# EasyEDA Pro project PCB_Power_supply.epro

# Board PCB7
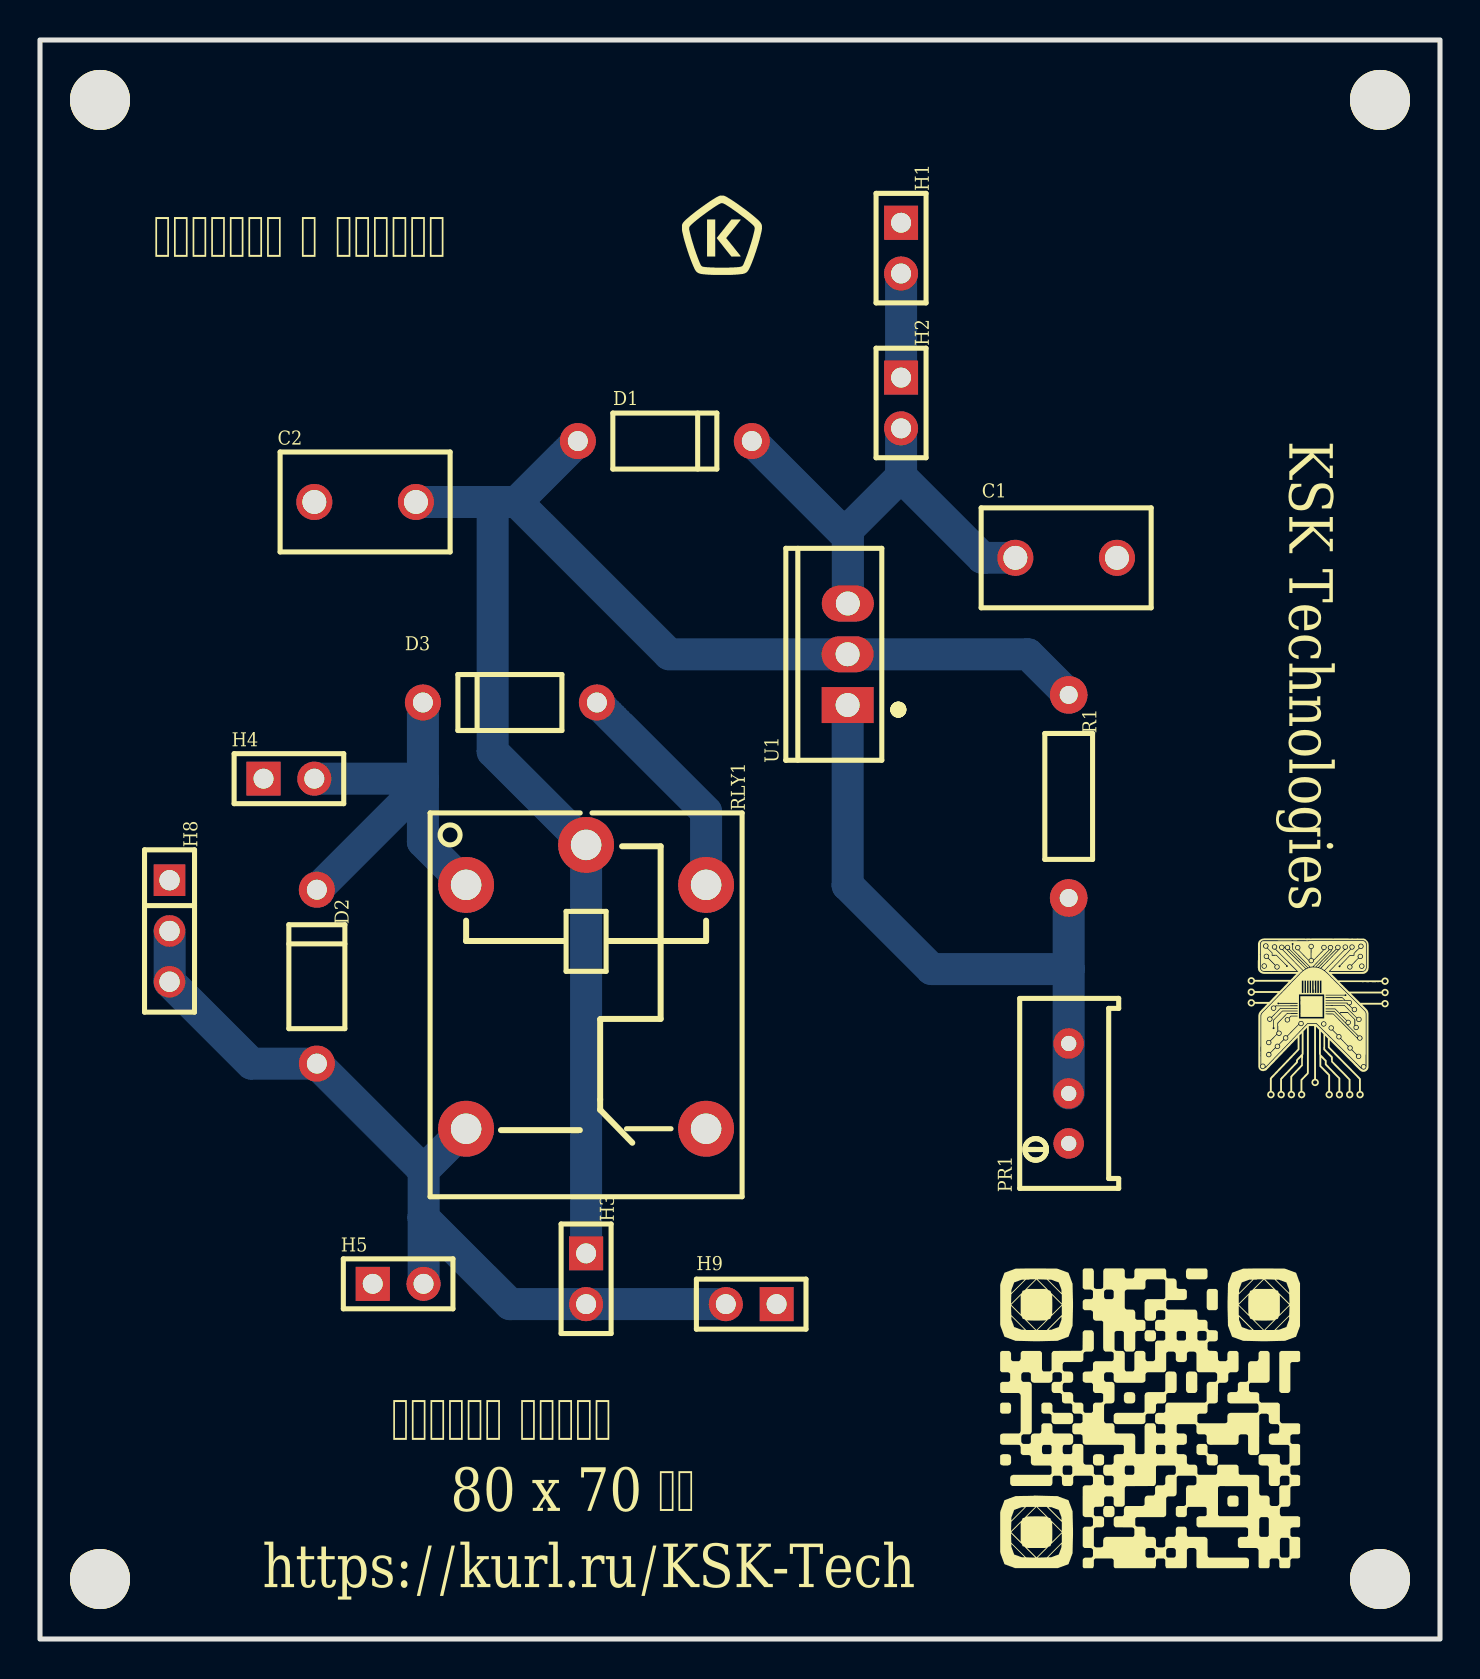
[diagram p0: board, top side]
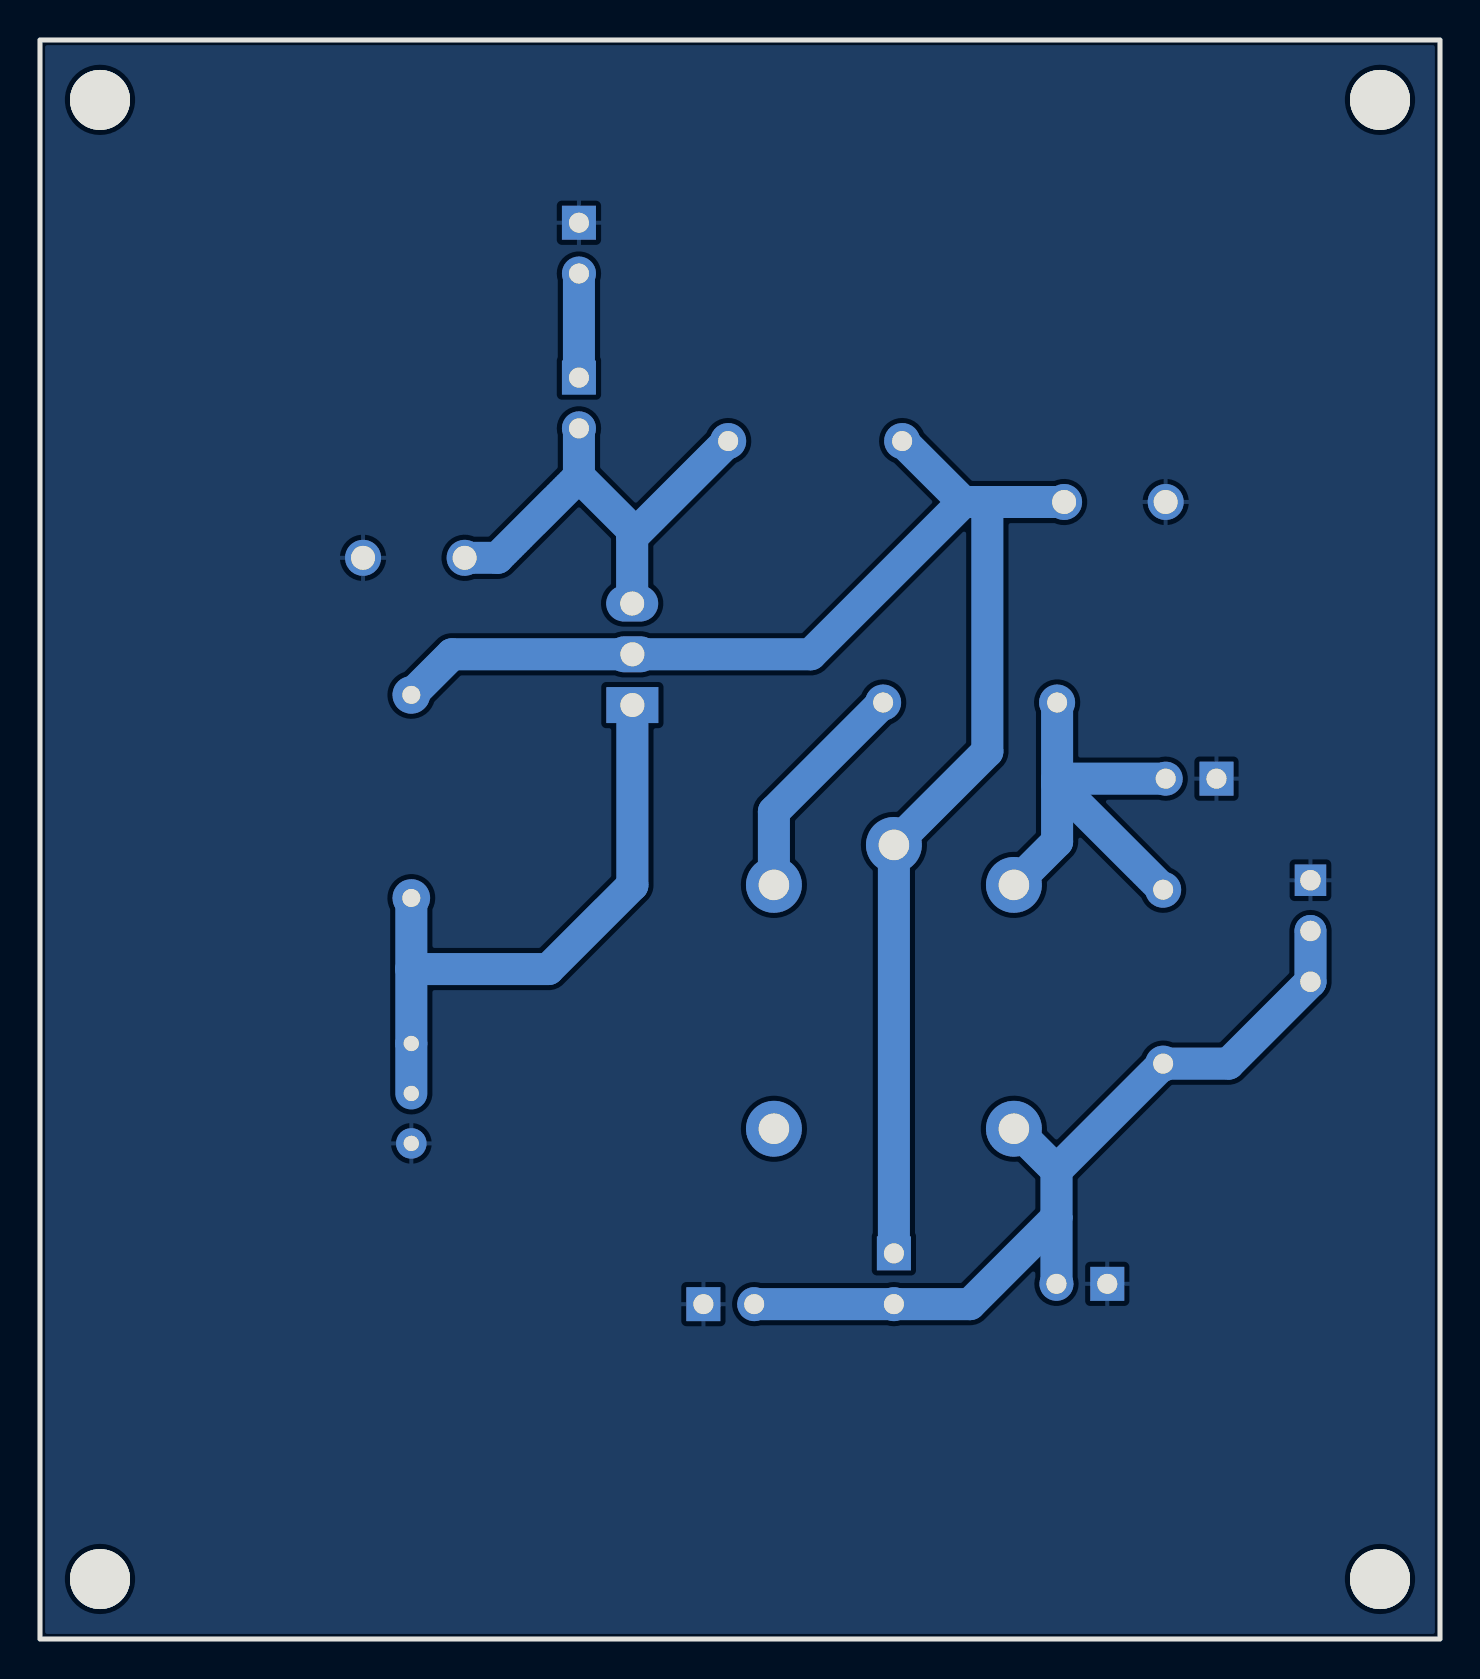
[diagram p1: board, bottom side, seen from below]

Outline 70 x 80 mm; copper layers: Top Layer, Bottom Layer. Coordinates in mm from the lower left corner of the outline.
Outline path: rectangle 0,80 70,0
Stack: Top Layer 0.035mm / Dielectric1 1.51mm FR4 er 4.5 / Bottom Layer 0.035mm

## Design rules (mm)
template: JLCPCB Capability(Two Layers Board)
spacing copperThickness1oz (default): track to track 0.102, other pairs 0.152 to 0.3
spacing copperThickness2oz: track to track 0.203, other pairs 0.152 to 0.3
track width copperThickness1oz (default): min 0.127, default 0.254, max 2.54
track width copperThickness2oz: min 0.203, default 0.254, max 2.54
differential pair differentialPair (default): width min 0.127, default 0.254, max 2.54; gap min 0.152, default 0.152
via viaSize (default): diameter min 0.5, default 0.61, max 10; hole min 0.3, default 0.305, max 6.3

## Placement (name value [footprint] x y rotation side)
C1  100nF  [CAP-TH_L8.5-W5.0-P5.00-D1.2]  51.31 54.09 180 top
C2  1uF  [CAP-TH_L8.5-W5.0-P5.00-D1.2]  16.26 56.89 0 top
D1  1N4001  [DO-41_BD2.4-L4.7-P8.70-D0.9-RD]  31.24 59.93 180 top
D2  1N4001  [DO-41_BD2.4-L4.7-P8.70-D0.9-RD]  13.84 33.14 270 top
D3  1N4001  [DO-41_BD2.4-L4.7-P8.70-D0.9-RD]  23.5 46.85 0 top
H1  Вход  [HDR-TH_2P-P2.54-V-F]  43.05 69.59 270 top
H2  Выключатель  [HDR-TH_2P-P2.54-V-F]  43.05 61.84 270 top
H3  Кнопка пуска  [HDR-TH_2P-P2.54-V-F]  27.3 18.02 270 top
H4  Светодиод  [HDR-TH_2P-P2.54-V-F]  12.45 43.04 0 top
H5  USB  [HDR-TH_2P-P2.54-V-F]  17.91 17.77 0 top
H8  Вольтметр  [HDR-TH_3P-P2.54-V-F]  6.48 35.42 270 top
H9  Выход  [HDR-TH_2P-P2.54-V-F]  35.56 16.75 180 top
NOREF  -  [Pad_e175]  3 77 0 top
NOREF#2  -  [Pad_e174]  3 3 0 top
NOREF#3  -  [Pad_e173]  67 3 0 top
NOREF#4  -  [Pad_e167]  67 77 0 top
PR1  10kΩ  [RES-ADJ-TH_3P-L10.0-W10.0-P2.50-L]  51.44 27.29 90 top
R1  10kΩ  [R_AXIAL-0.4]  51.44 42.15 90 top
RLY1  SRD-05VDC-SL-C  [RELAY-TH_SRD-XXVDC-XL-C]  27.3 32.63 270 top
U1  LM317  [TO-220-3_L10.0-W4.5-P2.54-L]  40.39 49.27 90 top

## Footprints (pads in the part's own frame, mm; a bottom-side part is the same pattern mirrored in y, then rotated)
CAP-TH_L8.5-W5.0-P5.00-D1.2
  round 1.8 hole 1.2: 1(-2.54,0) 2(2.54,0)
DO-41_BD2.4-L4.7-P8.70-D0.9-RD
  round 1.8 hole 1: 1(-4.35,0) 2(4.35,0)
HDR-TH_2P-P2.54-V-F
  rect 1.7x1.7 hole 1: 1(-1.27,0)
  round 1.7 hole 1: 2(1.27,0)
HDR-TH_3P-P2.54-V-F
  rect 1.575x1.575 hole 1.02: 1(-2.54,0)
  round 1.575 hole 1.02: 2(0,0) 3(2.54,0)
Pad_e167
  round 3 hole 4x3: 1(0,0)
Pad_e173
  round 3 hole 3: 1(0,0)
Pad_e174
  round 3 hole 3: 1(0,0)
Pad_e175
  round 3 hole 3: 1(0,0)
R_AXIAL-0.4
  round 1.879 hole 0.899: 1(-5.08,0) 2(5.08,0)
RELAY-TH_SRD-XXVDC-XL-C
  round 2.794 hole 1.524: 1(-5.1,-6) 2(7.1,-6) 3(7.1,6) 4(-5.1,6) 5(-7.1,0)
RES-ADJ-TH_3P-L10.0-W10.0-P2.50-L
  round 1.524 hole 0.762: 1(-2.5,0) 2(0,0) 3(2.5,0)
TO-220-3_L10.0-W4.5-P2.54-L
  rect 1.8x2.6 hole 1.2: 1(-2.54,0.005)
  oval 1.8x2.6 hole 1.2: 2(0,0.005) 3(2.54,-0.005)

## Nets
GND: C1.1 C2.1 H1.1 H4.1 H5.1 H8.1 H9.1 PR1.1
+: D2.2 H3.2 H5.2 H8.2 H8.3 H9.2 RLY1.2
LED: D2.1 D3.1 H4.2 RLY1.1
VR_OUTPUT: C2.2 D1.2 H3.1 R1.2 RLY1.5 U1.2
$1N314: H1.2 H2.1
$1N320: C1.2 D1.1 H2.2 U1.3
$1N490: PR1.2 PR1.3 R1.1 U1.1
$1N1268: D3.2 RLY1.4

Pads without a net: NOREF 1; NOREF#2 1; NOREF#3 1; NOREF#4 1; RLY1 3

## Routing (per net, layer and track width the routed paths; a pad name or vN(x,y) marks a point on that pad's centre or on a via; arc(x,y) is an arc through that point)
+: length 44.7
  Bottom Layer w1.6: H9.2 H3.2 23.5,16.75 19.18,21.08 ; 19.18,23.45 19.18,21.08 ; 19.18,23.45 D2.2 10.57,28.79 H8.3 H8.2 ; 19.18,23.45 21.25,25.53 RLY1.2 ; 19.18,21.08 H5.2
LED: length 22.9
  Bottom Layer w1.6: 19.14,42.79 D2.1 ; 19.14,42.79 D3.1 ; 19.14,42.79 19.14,39.89 RLY1.1 ; 13.72,43.04 19.14,43.04
VR_OUTPUT: length 80.5
  Bottom Layer w1.6: 22.63,56.89 23.84,56.89 ; 22.63,56.89 22.63,44.4 RLY1.5 H3.1 ; 22.63,56.89 C2.2 ; 23.84,56.89 D1.2 ; 23.84,56.89 31.46,49.27 U1.2 49.4,49.27 R1.2
$1N314: length 5.2
  Bottom Layer w1.6: H1.2 H2.1
$1N320: length 23.7
  Bottom Layer w1.6: 40.39,51.81 40.39,55.13 D1.1 ; H2.2 43.05,58.16 ; 43.05,58.16 47.12,54.09 C1.2 ; 43.05,58.16 40.39,55.49
$1N490: length 31.6
  Bottom Layer w1.6: PR1.2 PR1.3 51.44,33.53 ; R1.1 51.44,33.53 ; 51.44,33.53 51.42,33.52 44.58,33.52 40.38,37.71 U1.1
$1N1268: length 11.4
  Bottom Layer w1.6: RLY1.4 33.3,41.39 D3.2

## Copper pours and planes (outline as drawn; the poured copper is in the pictures)
GND on Bottom Layer: 0,80 70,80 70,0 0,0

## Text on the board
Top Silkscreen Layer: Сделано в России | https://kurl.ru/KSK-Tech | Размер платы | 80 x 70 мм | KSK Technologies
